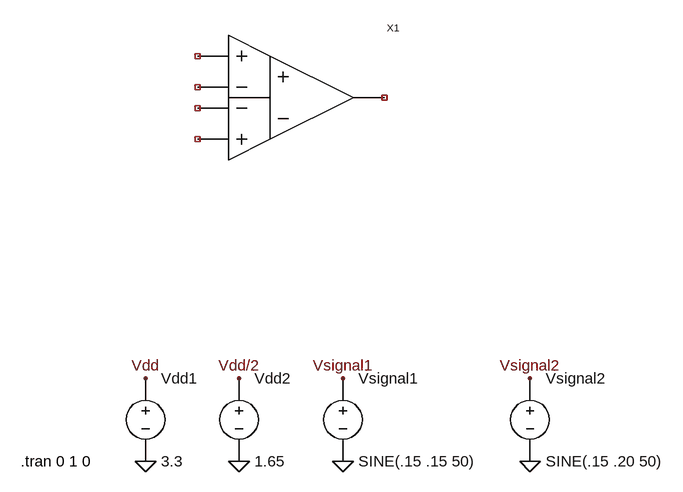
[diagram p0: schematic diff_amp_sim.asc]
diff_amp_sim.asc, the LTspice schematic file:
Version 4
SHEET 1 880 768
FLAG 256 704 0
FLAG 96 704 0
FLAG -48 704 0
FLAG -48 576 Vdd
FLAG 96 576 Vdd/2
FLAG 256 576 Vsignal1
FLAG 544 704 0
FLAG 544 576 Vsignal2
SYMBOL cktsym\\vsource -48 640 R0
SYMATTR Value 3.3
SYMATTR InstName Vdd1
SYMBOL cktsym\\vsource 96 640 R0
SYMATTR Value 1.65
SYMATTR InstName Vdd2
SYMBOL cktsym\\vsource 256 640 R0
WINDOW 123 0 0 Left 0
WINDOW 39 0 0 Left 0
SYMATTR Value SINE(.15 .15 50)
SYMATTR InstName Vsignal1
SYMBOL cktsym\\vsource 544 640 R0
WINDOW 123 0 0 Left 0
WINDOW 39 0 0 Left 0
SYMATTR Value SINE(.15 .20 50)
SYMATTR InstName Vsignal2
SYMBOL MCP6N11 192 144 R0
SYMATTR InstName X1
TEXT -240 704 Left 2 !.tran 0 1 0

The netlist it stands for:
* diff_amp_sim.asc
Vdd1 Vdd 0 3.3
Vdd2 Vdd/2 0 1.65
Vsignal1 Vsignal1 0 SINE(.15 .15 50)
Vsignal2 Vsignal2 0 SINE(.15 .20 50)
XX1 NC_01 NC_02 NC_03 NC_04 NC_05 MCP6N11  ; pins Vp Vm Vref Vfb Vout
.tran 0 1 0
.backanno
.end